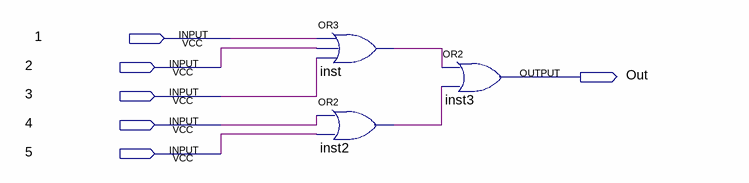
[diagram p0: schematic sheet]
// Quartus schematic 5or.bdf as structural Verilog: 3 symbols, 6 pins
module \5or  (
  input  \1 ,
  input  \2 ,
  input  \3 ,
  input  \4 ,
  input  \5 ,
  output Out
);

  wire inst2_out, inst_out;

  or inst (inst_out, \1 , \2 , \3 );
  or inst2 (inst2_out, \4 , \5 );
  or inst3 (Out, inst_out, inst2_out);
endmodule
